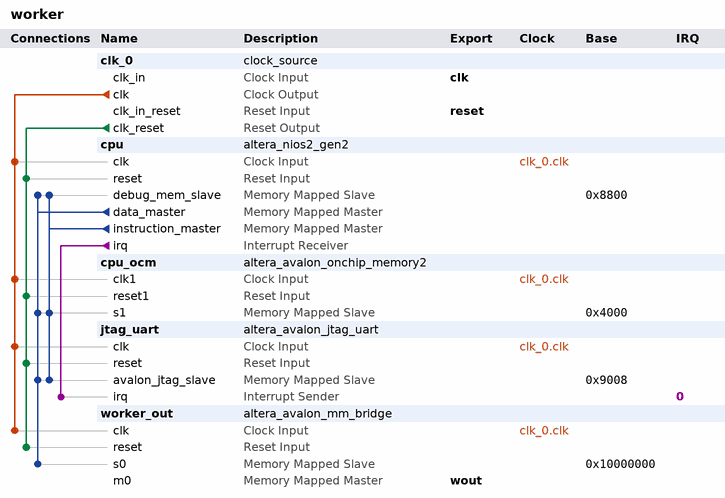
[diagram p0: system contents]
# Platform Designer (Qsys) system worker, Cyclone V 5CSEMA5F31C6
# Parameters at their usual value, and those the tool derives, are not listed.
package require -exact qsys 17.0
create_system worker
set_project_property DEVICE_FAMILY {Cyclone V}
set_project_property DEVICE 5CSEMA5F31C6

add_instance clk_0 clock_source 17.0
set_instance_parameter_value clk_0 clockFrequency 100000000
set_instance_parameter_value clk_0 clockFrequencyKnown false

add_instance cpu altera_nios2_gen2 17.0
set_instance_parameter_value cpu dcache_size 2048
set_instance_parameter_value cpu exceptionSlave cpu_ocm.s1
set_instance_parameter_value cpu icache_size 4096
set_instance_parameter_value cpu impl Fast
set_instance_parameter_value cpu resetSlave cpu_ocm.s1

add_instance cpu_ocm altera_avalon_onchip_memory2 17.0
set_instance_parameter_value cpu_ocm dataWidth 32
set_instance_parameter_value cpu_ocm dualPort false
set_instance_parameter_value cpu_ocm initMemContent false
set_instance_parameter_value cpu_ocm initializationFileName onchip_mem.hex
set_instance_parameter_value cpu_ocm memorySize 16384

add_instance jtag_uart altera_avalon_jtag_uart 17.0
set_instance_parameter_value jtag_uart simInteractiveOptions NO_INTERACTIVE_WINDOWS

add_instance worker_out altera_avalon_mm_bridge 17.0
set_instance_parameter_value worker_out ADDRESS_UNITS SYMBOLS
set_instance_parameter_value worker_out ADDRESS_WIDTH 28
set_instance_parameter_value worker_out DATA_WIDTH 32
set_instance_parameter_value worker_out MAX_PENDING_RESPONSES 4
set_instance_parameter_value worker_out USE_AUTO_ADDRESS_WIDTH 0

# connections
add_connection clk_0.clk cpu.clk clock
add_connection clk_0.clk cpu_ocm.clk1 clock
add_connection clk_0.clk jtag_uart.clk clock
add_connection clk_0.clk worker_out.clk clock
add_connection clk_0.clk_reset cpu.reset reset
add_connection clk_0.clk_reset cpu_ocm.reset1 reset
add_connection clk_0.clk_reset jtag_uart.reset reset
add_connection clk_0.clk_reset worker_out.reset reset
add_connection cpu.data_master cpu.debug_mem_slave avalon
set_connection_parameter_value cpu.data_master/cpu.debug_mem_slave baseAddress 0x8800
add_connection cpu.data_master cpu_ocm.s1 avalon
set_connection_parameter_value cpu.data_master/cpu_ocm.s1 baseAddress 0x4000
add_connection cpu.data_master jtag_uart.avalon_jtag_slave avalon
set_connection_parameter_value cpu.data_master/jtag_uart.avalon_jtag_slave baseAddress 0x9008
add_connection cpu.data_master worker_out.s0 avalon
set_connection_parameter_value cpu.data_master/worker_out.s0 baseAddress 0x10000000
add_connection cpu.instruction_master cpu.debug_mem_slave avalon
set_connection_parameter_value cpu.instruction_master/cpu.debug_mem_slave baseAddress 0x8800
add_connection cpu.instruction_master cpu_ocm.s1 avalon
set_connection_parameter_value cpu.instruction_master/cpu_ocm.s1 baseAddress 0x4000
add_connection cpu.instruction_master jtag_uart.avalon_jtag_slave avalon
set_connection_parameter_value cpu.instruction_master/jtag_uart.avalon_jtag_slave baseAddress 0x9008
add_connection cpu.irq jtag_uart.irq interrupt
set_connection_parameter_value cpu.irq/jtag_uart.irq irqNumber 0

# exported interfaces
add_interface clk clock sink
set_interface_property clk EXPORT_OF clk_0.clk_in
add_interface reset reset sink
set_interface_property reset EXPORT_OF clk_0.clk_in_reset
add_interface wout avalon master
set_interface_property wout EXPORT_OF worker_out.m0

set_interconnect_requirement {$system} qsys_mm.clockCrossingAdapter HANDSHAKE
set_interconnect_requirement {$system} qsys_mm.enableEccProtection FALSE
set_interconnect_requirement {$system} qsys_mm.insertDefaultSlave FALSE
set_interconnect_requirement {$system} qsys_mm.maxAdditionalLatency 1

save_system worker.qsys
